# Altium schematic sheet sesnor schematic.SchDoc
size A1; Organization: Altium Limited; Address1: L3, 12a Rodborough Rd; Address2: Frenchs Forest; Address3: NSW; Address4: Australia 2086
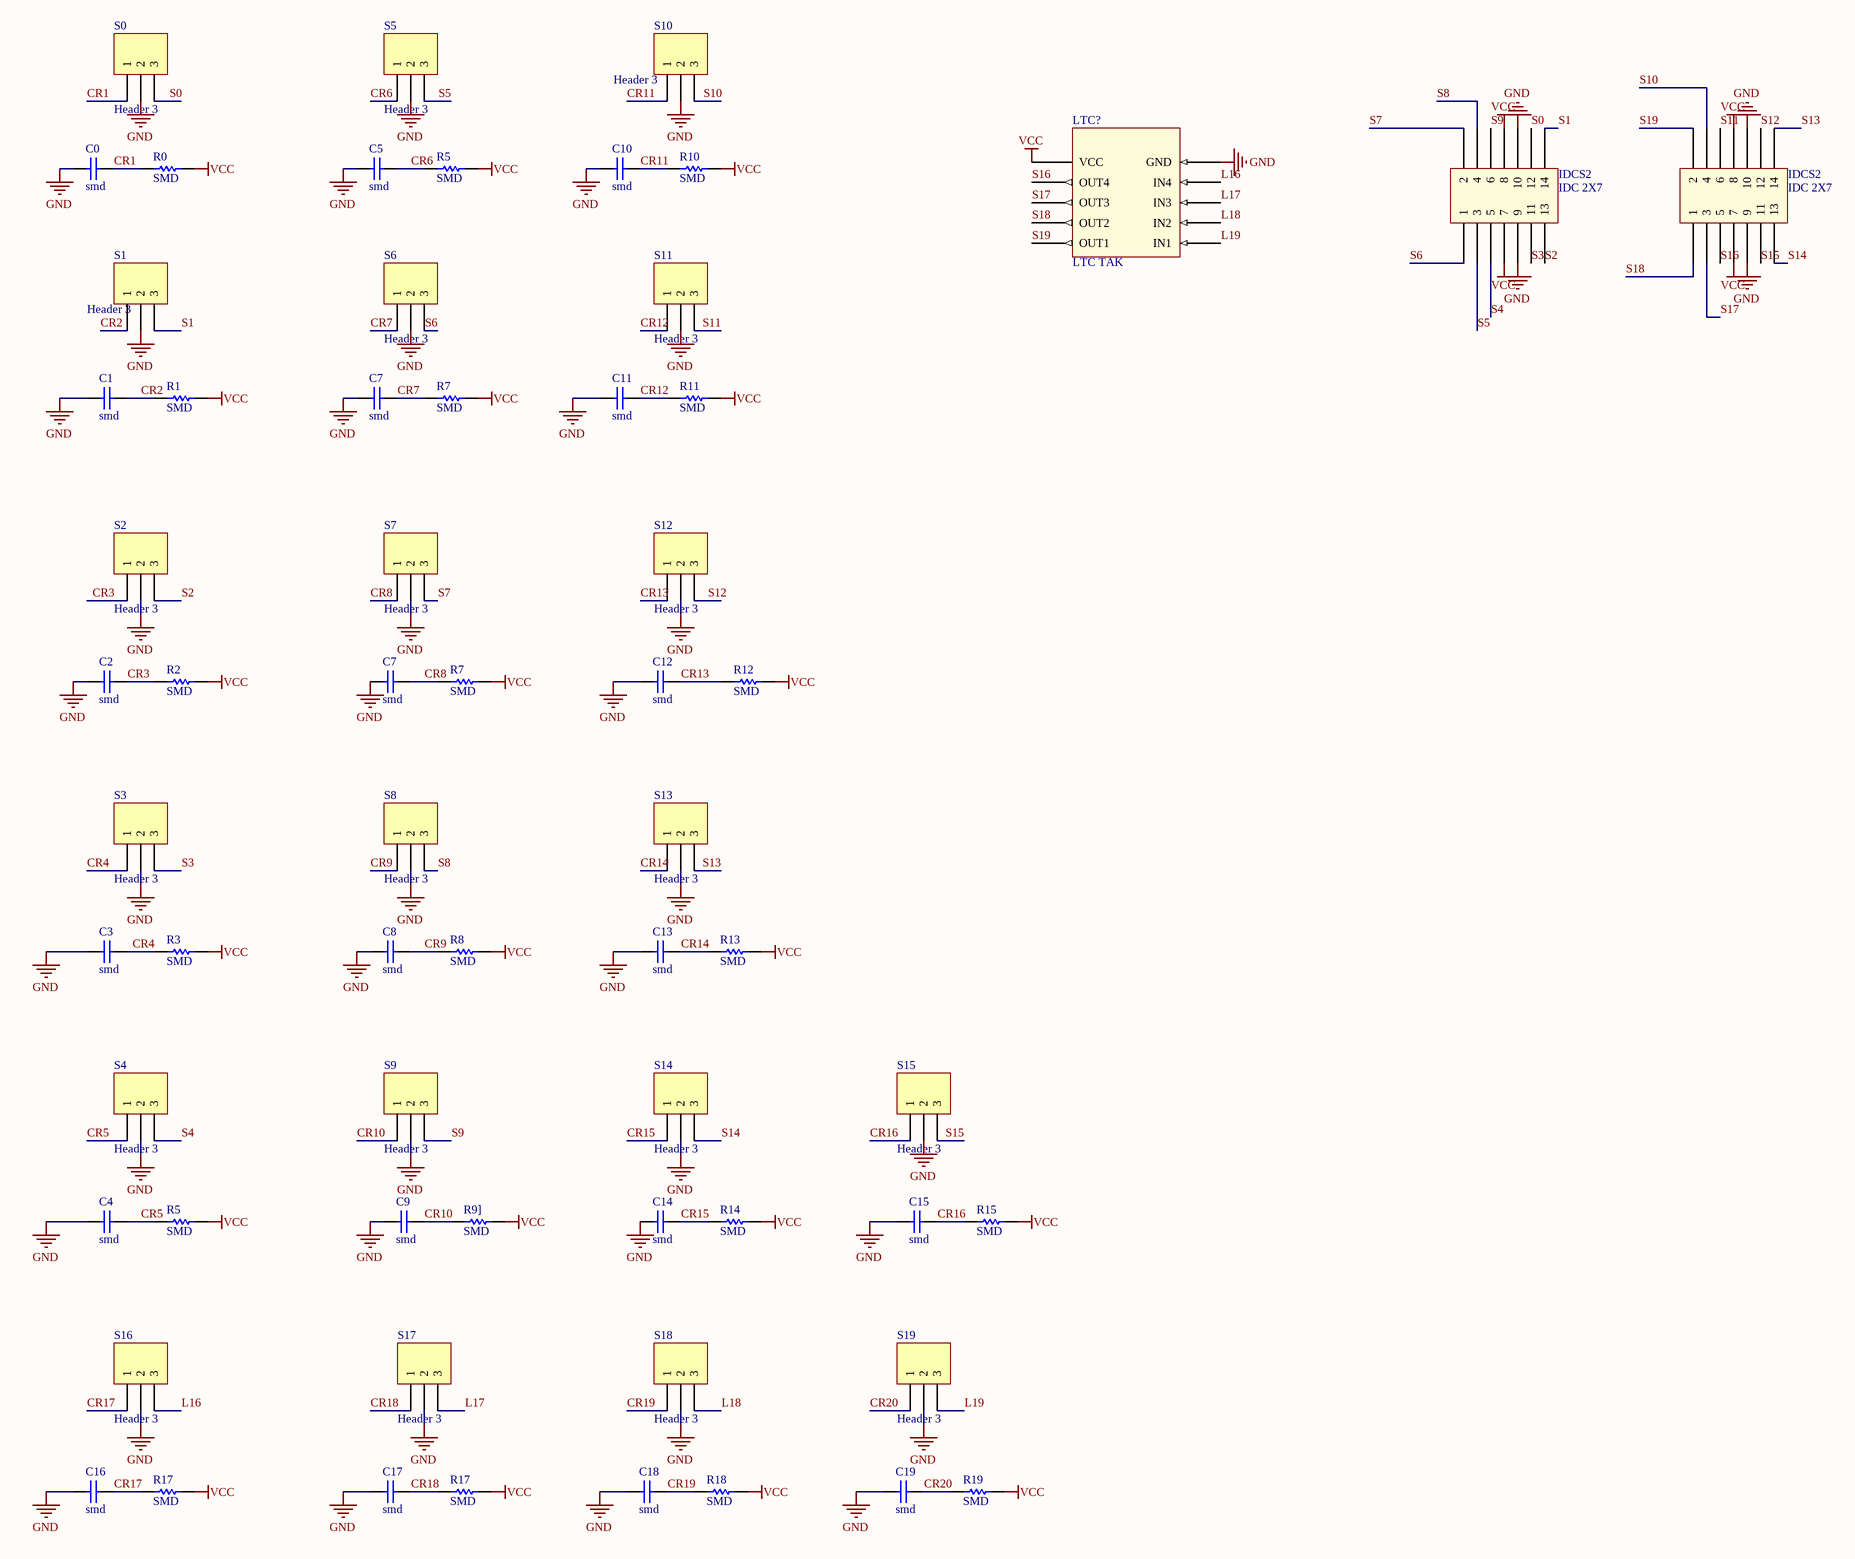
[diagram p0: sesnor schematic.SchDoc]

## Parts
(Parts that share a designator on the sheet are numbered #1, #2 ... from top to bottom, then left to right.)
C0  smd  [Cap SMD]
C1  smd  [Cap SMD]
C2  smd  [Cap SMD]
C3  smd  [Cap SMD]
C4  smd  [Cap SMD]
C5  smd  [Cap SMD]
C7#1  smd  [Cap SMD]
C7#2  smd  [Cap SMD]
C8  smd  [Cap SMD]
C9  smd  [Cap SMD]
C10  smd  [Cap SMD]
C11  smd  [Cap SMD]
C12  smd  [Cap SMD]
C13  smd  [Cap SMD]
C14  smd  [Cap SMD]
C15  smd  [Cap SMD]
C16  smd  [Cap SMD]
C17  smd  [Cap SMD]
C18  smd  [Cap SMD]
C19  smd  [Cap SMD]
IDCS2#1  IDC 2X7  [IDC 2X7]
IDCS2#2  IDC 2X7  [IDC 2X7]
LTC?  LTC TAK  [LTC TAK]
R0  SMD  [Resistor SMD 1206]
R1  SMD  [Resistor SMD 1206]
R2  SMD  [Resistor SMD 1206]
R3  SMD  [Resistor SMD 1206]
R5#1  SMD  [Resistor SMD 1206]
R5#2  SMD  [Resistor SMD 1206]
R7#1  SMD  [Resistor SMD 1206]
R7#2  SMD  [Resistor SMD 1206]
R8  SMD  [Resistor SMD 1206]
R9]  SMD  [Resistor SMD 1206]
R10  SMD  [Resistor SMD 1206]
R11  SMD  [Resistor SMD 1206]
R12  SMD  [Resistor SMD 1206]
R13  SMD  [Resistor SMD 1206]
R14  SMD  [Resistor SMD 1206]
R15  SMD  [Resistor SMD 1206]
R17#1  SMD  [Resistor SMD 1206]
R17#2  SMD  [Resistor SMD 1206]
R18  SMD  [Resistor SMD 1206]
R19  SMD  [Resistor SMD 1206]
S0  Header 3  [HDR1X3]
S1  Header 3  [HDR1X3]
S2  Header 3  [HDR1X3]
S3  Header 3  [HDR1X3]
S4  Header 3  [HDR1X3]
S5  Header 3  [HDR1X3]
S6  Header 3  [HDR1X3]
S7  Header 3  [HDR1X3]
S8  Header 3  [HDR1X3]
S9  Header 3  [HDR1X3]
S10  Header 3  [HDR1X3]
S11  Header 3  [HDR1X3]
S12  Header 3  [HDR1X3]
S13  Header 3  [HDR1X3]
S14  Header 3  [HDR1X3]
S15  Header 3  [HDR1X3]
S16  Header 3  [HDR1X3]
S17  Header 3  [HDR1X3]
S18  Header 3  [HDR1X3]
S19  Header 3  [HDR1X3]

## Nets
GND: C0.1 C1.1 C2.1 C3.1 C4.1 C5.1 C7#1.1 C7#2.1 C8.1 C9.1 C10.1 C11.1 C12.1 C13.1 C14.1 C15.1 C16.1 C17.1 C18.1 C19.1 IDCS2#1.9 IDCS2#1.10 IDCS2#2.9 IDCS2#2.10 LTC?.10(GND) S0.2 S1.2 S2.2 S3.2 S4.2 S5.2 S6.2 S7.2 S8.2 S9.2 S10.2 S11.2 S12.2 S13.2 S14.2 S15.2 S16.2 S17.2 S18.2 S19.2
VCC: IDCS2#1.7 IDCS2#1.8 IDCS2#2.7 IDCS2#2.8 LTC?.1(VCC) R0.2 R1.2 R2.2 R3.2 R5#1.2 R5#2.2 R7#1.2 R7#2.2 R8.2 R9].2 R10.2 R11.2 R12.2 R13.2 R14.2 R15.2 R17#1.2 R17#2.2 R18.2 R19.2
CR1: C0.2 R0.1 S0.1
CR2: C1.2 R1.1 S1.1
CR3: C2.2 R2.1 S2.1
CR4: C3.2 R3.1 S3.1
CR5: C4.2 R5#2.1 S4.1
CR6: C5.2 R5#1.1 S5.1
CR7: C7#1.2 R7#1.1 S6.1
CR8: C7#2.2 R7#2.1 S7.1
CR9: C8.2 R8.1 S8.1
CR10: C9.2 R9].1 S9.1
CR11: C10.2 R10.1 S10.1
CR12: C11.2 R11.1 S11.1
CR13: C12.2 R12.1 S12.1
CR14: C13.2 R13.1 S13.1
CR15: C14.2 R14.1 S14.1
CR16: C15.2 R15.1 S15.1
CR17: C16.2 R17#1.1 S16.1
CR18: C17.2 R17#2.1 S17.1
CR19: C18.2 R18.1 S18.1
CR20: C19.2 R19.1 S19.1
L16: LTC?.9(IN4) S16.3
L17: LTC?.8(IN3) S17.3
L18: LTC?.7(IN2) S18.3
L19: LTC?.6(IN1) S19.3
S0: IDCS2#1.12 S0.3
S1: IDCS2#1.14 S1.3
S2: IDCS2#1.13 S2.3
S3: IDCS2#1.11 S3.3
S4: IDCS2#1.5 S4.3
S5: IDCS2#1.3 S5.3
S6: IDCS2#1.1 S6.3
S7: IDCS2#1.2 S7.3
S8: IDCS2#1.4 S8.3
S9: IDCS2#1.6 S9.3
S10: IDCS2#2.4 S10.3
S11: IDCS2#2.6 S11.3
S12: IDCS2#2.12 S12.3
S13: IDCS2#2.14 S13.3
S14: IDCS2#2.13 S14.3
S15: IDCS2#2.11 S15.3
S16: IDCS2#2.5 LTC?.2(OUT4)
S17: IDCS2#2.3 LTC?.3(OUT3)
S18: IDCS2#2.1 LTC?.4(OUT2)
S19: IDCS2#2.2 LTC?.5(OUT1)

## Notes on the sheet
- Title
- Size:
- Date:
- File:
- A1
- Number:
- Time:
- Revision:
- Sheet
- of

## Library data of the parts
C0-C5 C7#1 C7#2 C8-C19 = Cap SMD
R0-R3 R5#1 R5#2 R7#1 R7#2 R8 R9] R10-R15 R17#1 R17#2 R18 R19 = Res SMD
S0-S19 = Header 3: Header, 3-Pin; LatestRevisionDate: 17-Jul-2002; LatestRevisionNote: Re-released for DXP Platform.; Publisher: Altium Limited